# EAGLE schematic module_core_2 (EAGLE 5.10)
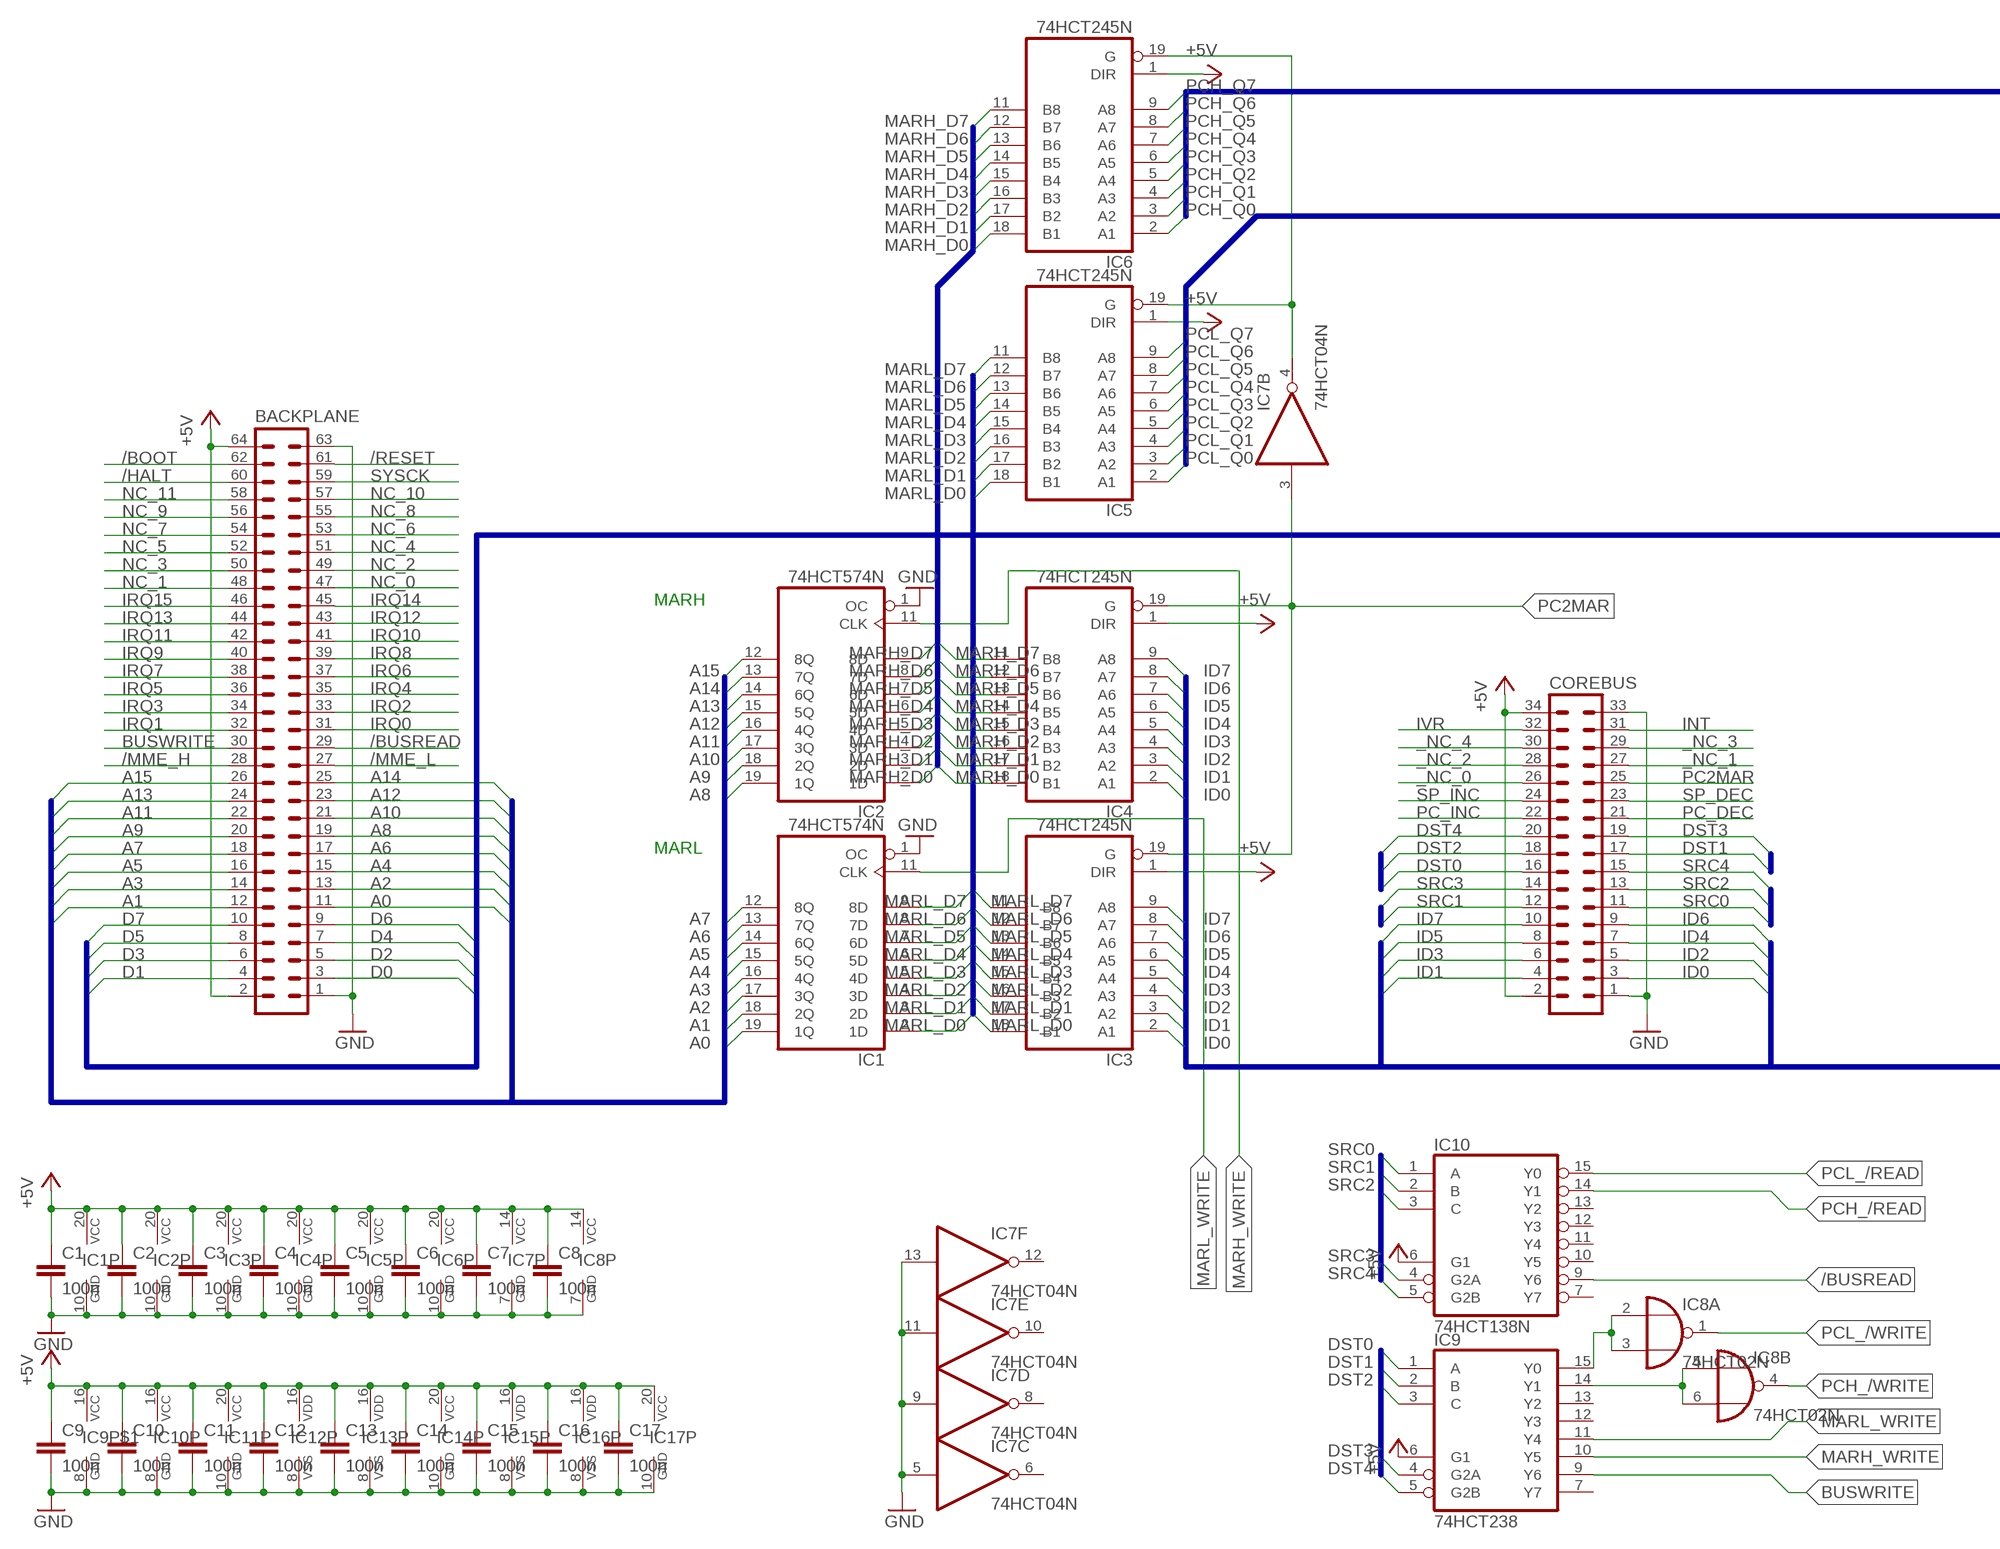
[diagram p0: schematic, sheet 1, part 1 of 2]
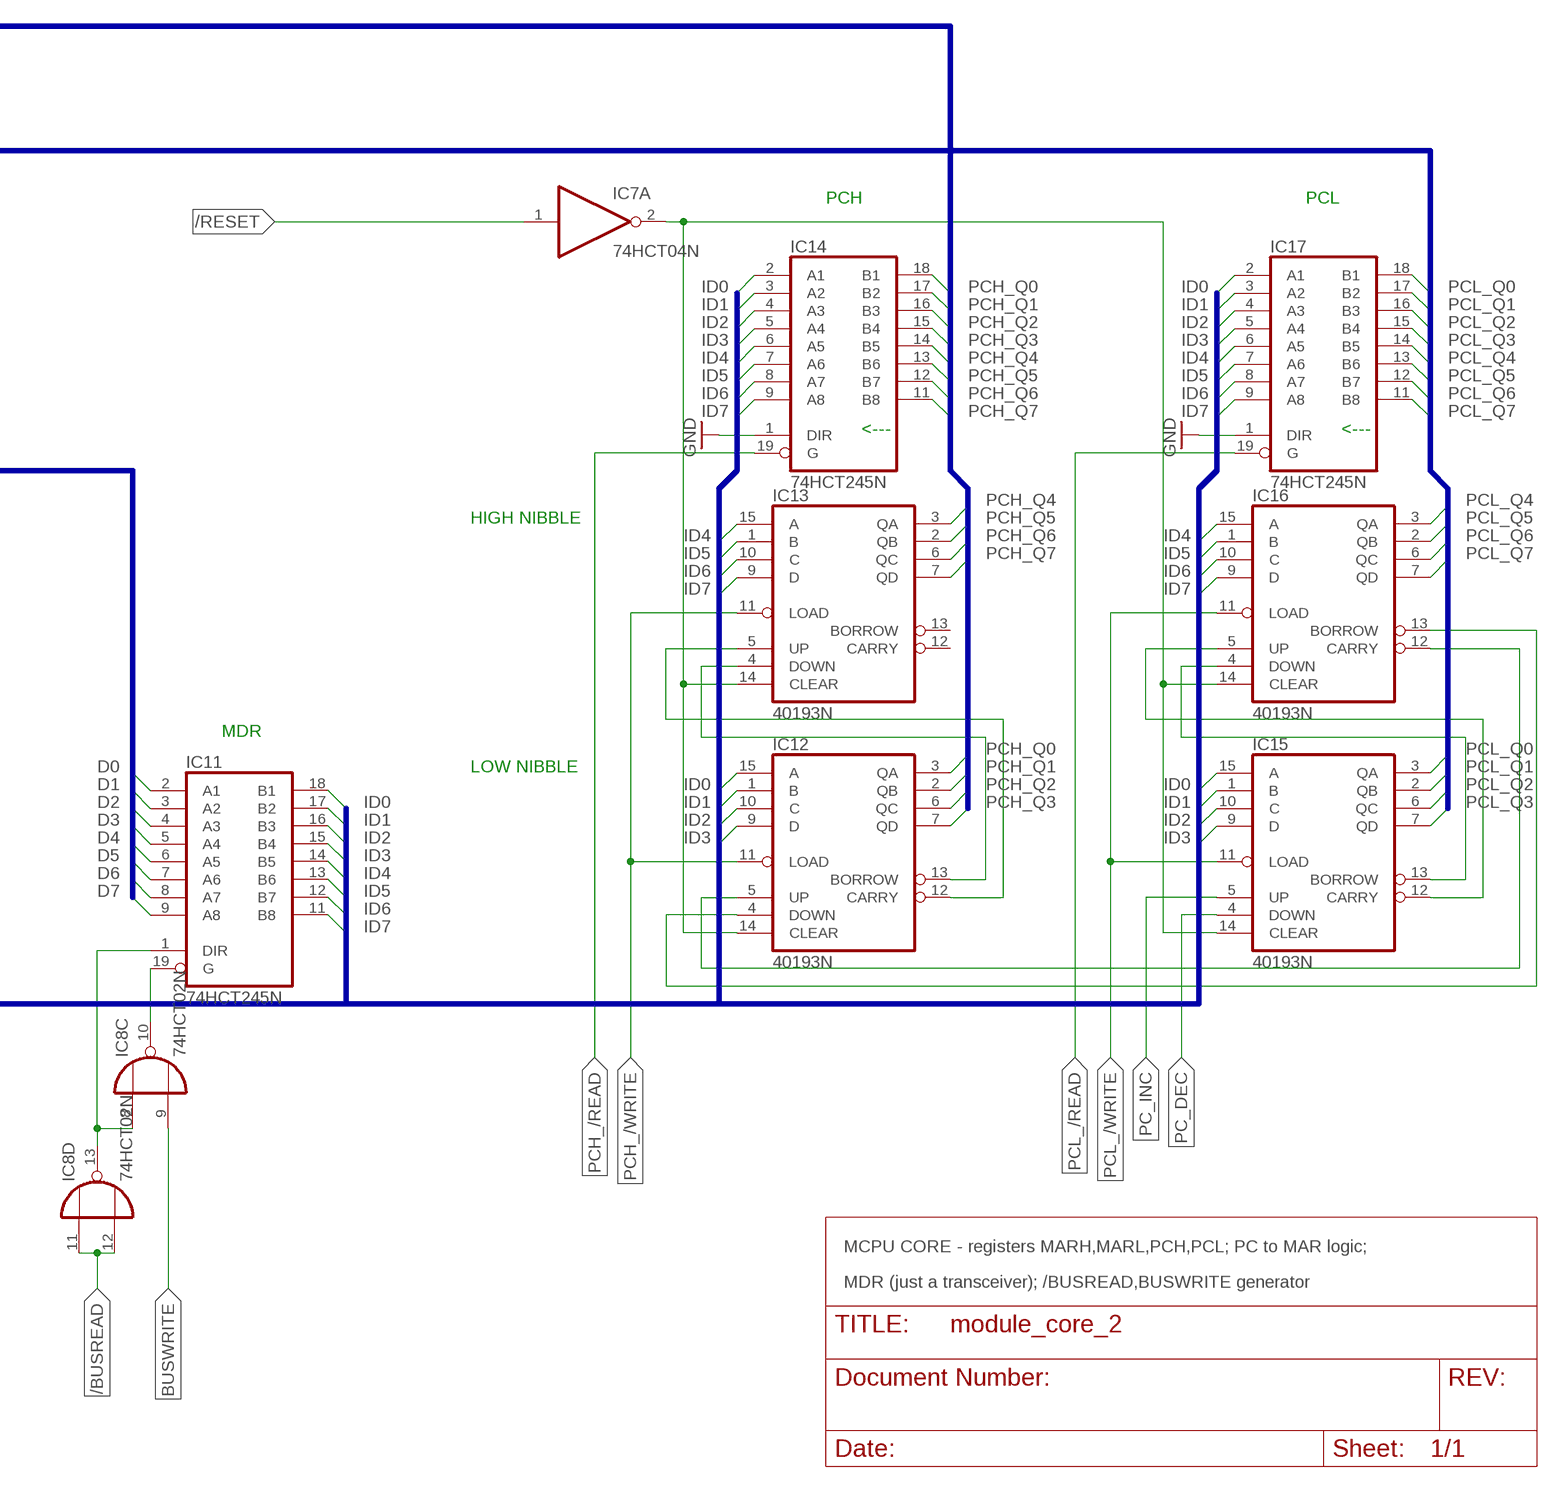
[diagram p1: schematic, sheet 1, part 2 of 2]

## Parts
BACKPLANE  ML64L  [ML64L]
C1  100n  C-EUC1206  [C1206]
C2  100n  C-EUC1206  [C1206]
C3  100n  C-EUC1206  [C1206]
C4  100n  C-EUC1206  [C1206]
C5  100n  C-EUC1206  [C1206]
C6  100n  C-EUC1206  [C1206]
C7  100n  C-EUC1206  [C1206]
C8  100n  C-EUC1206  [C1206]
C9  100n  C-EUC1206  [C1206]
C10  100n  C-EUC1206  [C1206]
C11  100n  C-EUC1206  [C1206]
C12  100n  C-EUC1206  [C1206]
C13  100n  C-EUC1206  [C1206]
C14  100n  C-EUC1206  [C1206]
C15  100n  C-EUC1206  [C1206]
C16  100n  C-EUC1206  [C1206]
C17  100n  C-EUC1206  [C1206]
COREBUS  ML34L  [ML34L]
IC1  74HCT574N  [DIL20]
IC2  74HCT574N  [DIL20]
IC3  74HCT245N  [DIL20]
IC4  74HCT245N  [DIL20]
IC5  74HCT245N  [DIL20]
IC6  74HCT245N  [DIL20]
IC7  74HCT04N  [DIL14]
IC8  74HCT02N  [DIL14]
IC9  74HCT238  [DIL16]
IC10  74HCT138N  [DIL16]
IC11  74HCT245N  [DIL20]
IC12  40193N  [DIL16]
IC13  40193N  [DIL16]
IC14  74HCT245N  [DIL20]
IC15  40193N  [DIL16]
IC16  40193N  [DIL16]
IC17  74HCT245N  [DIL20]

## Nets
+5V: BACKPLANE.2 BACKPLANE.64 C1.1 C2.1 C3.1 C4.1 C5.1 C6.1 C7.1 C8.1 C9.1 C10.1 C11.1 C12.1 C13.1 C14.1 C15.1 C16.1 C17.1 COREBUS.2 COREBUS.34 IC1.20(VCC) IC2.20(VCC) IC3.1(DIR) IC3.20(VCC) IC4.1(DIR) IC4.20(VCC) IC5.1(DIR) IC5.20(VCC) IC6.1(DIR) IC6.20(VCC) IC7.14(P:VCC) IC8.14(P:VCC) IC9.6(G1) IC9.16(VCC) IC10.6(G1) IC10.16(VCC) IC11.20(VCC) IC12.16(VDD) IC13.16(VDD) IC14.20(VCC) IC15.16(VDD) IC16.16(VDD) IC17.20(VCC)
/BOOT: BACKPLANE.62
/BUSREAD: BACKPLANE.29 IC8.11(D:I0) IC8.12(D:I1) IC10.9(Y6)
/HALT: BACKPLANE.60
/MME_H: BACKPLANE.28
/MME_L: BACKPLANE.27
/RESET: BACKPLANE.61 IC7.1(A:I)
_NC_0: COREBUS.26
_NC_1: COREBUS.27
_NC_2: COREBUS.28
_NC_3: COREBUS.29
_NC_4: COREBUS.30
A0: BACKPLANE.11 IC1.19(1Q)
A1: BACKPLANE.12 IC1.18(2Q)
A2: BACKPLANE.13 IC1.17(3Q)
A3: BACKPLANE.14 IC1.16(4Q)
A4: BACKPLANE.15 IC1.15(5Q)
A5: BACKPLANE.16 IC1.14(6Q)
A6: BACKPLANE.17 IC1.13(7Q)
A7: BACKPLANE.18 IC1.12(8Q)
A8: BACKPLANE.19 IC2.19(1Q)
A9: BACKPLANE.20 IC2.18(2Q)
A10: BACKPLANE.21 IC2.17(3Q)
A11: BACKPLANE.22 IC2.16(4Q)
A12: BACKPLANE.23 IC2.15(5Q)
A13: BACKPLANE.24 IC2.14(6Q)
A14: BACKPLANE.25 IC2.13(7Q)
A15: BACKPLANE.26 IC2.12(8Q)
BUSWRITE: BACKPLANE.30 IC8.9(C:I1) IC9.9(Y6)
D0: BACKPLANE.3 IC11.2(A1)
D1: BACKPLANE.4 IC11.3(A2)
D2: BACKPLANE.5 IC11.4(A3)
D3: BACKPLANE.6 IC11.5(A4)
D4: BACKPLANE.7 IC11.6(A5)
D5: BACKPLANE.8 IC11.7(A6)
D6: BACKPLANE.9 IC11.8(A7)
D7: BACKPLANE.10 IC11.9(A8)
DST0: COREBUS.16 IC9.1(A)
DST1: COREBUS.17 IC9.2(B)
DST2: COREBUS.18 IC9.3(C)
DST3: COREBUS.19 IC9.4(G2A)
DST4: COREBUS.20 IC9.5(G2B)
GND: BACKPLANE.1 BACKPLANE.63 C1.2 C2.2 C3.2 C4.2 C5.2 C6.2 C7.2 C8.2 C9.2 C10.2 C11.2 C12.2 C13.2 C14.2 C15.2 C16.2 C17.2 COREBUS.1 COREBUS.33 IC1.1(OC) IC1.10(GND) IC2.1(OC) IC2.10(GND) IC3.10(GND) IC4.10(GND) IC5.10(GND) IC6.10(GND) IC7.5(C:I) IC7.7(P:GND) IC7.9(D:I) IC7.11(E:I) IC7.13(F:I) IC8.7(P:GND) IC9.8(GND) IC10.8(GND) IC11.10(GND) IC12.8(VSS) IC13.8(VSS) IC14.1(DIR) IC14.10(GND) IC15.8(VSS) IC16.8(VSS) IC17.1(DIR) IC17.10(GND)
ID0: COREBUS.3 IC3.2(A1) IC4.2(A1) IC11.18(B1) IC12.15(A) IC14.2(A1) IC15.15(A) IC17.2(A1)
ID1: COREBUS.4 IC3.3(A2) IC4.3(A2) IC11.17(B2) IC12.1(B) IC14.3(A2) IC15.1(B) IC17.3(A2)
ID2: COREBUS.5 IC3.4(A3) IC4.4(A3) IC11.16(B3) IC12.10(C) IC14.4(A3) IC15.10(C) IC17.4(A3)
ID3: COREBUS.6 IC3.5(A4) IC4.5(A4) IC11.15(B4) IC12.9(D) IC14.5(A4) IC15.9(D) IC17.5(A4)
ID4: COREBUS.7 IC3.6(A5) IC4.6(A5) IC11.14(B5) IC13.15(A) IC14.6(A5) IC16.15(A) IC17.6(A5)
ID5: COREBUS.8 IC3.7(A6) IC4.7(A6) IC11.13(B6) IC13.1(B) IC14.7(A6) IC16.1(B) IC17.7(A6)
ID6: COREBUS.9 IC3.8(A7) IC4.8(A7) IC11.12(B7) IC13.10(C) IC14.8(A7) IC16.10(C) IC17.8(A7)
ID7: COREBUS.10 IC3.9(A8) IC4.9(A8) IC11.11(B8) IC13.9(D) IC14.9(A8) IC16.9(D) IC17.9(A8)
INT: COREBUS.31
IRQ0: BACKPLANE.31
IRQ1: BACKPLANE.32
IRQ2: BACKPLANE.33
IRQ3: BACKPLANE.34
IRQ4: BACKPLANE.35
IRQ5: BACKPLANE.36
IRQ6: BACKPLANE.37
IRQ7: BACKPLANE.38
IRQ8: BACKPLANE.39
IRQ9: BACKPLANE.40
IRQ10: BACKPLANE.41
IRQ11: BACKPLANE.42
IRQ12: BACKPLANE.43
IRQ13: BACKPLANE.44
IRQ14: BACKPLANE.45
IRQ15: BACKPLANE.46
IVR: COREBUS.32
MARH_D0: IC2.2(1D) IC4.18(B1) IC6.18(B1)
MARH_D1: IC2.3(2D) IC4.17(B2) IC6.17(B2)
MARH_D2: IC2.4(3D) IC4.16(B3) IC6.16(B3)
MARH_D3: IC2.5(4D) IC4.15(B4) IC6.15(B4)
MARH_D4: IC2.6(5D) IC4.14(B5) IC6.14(B5)
MARH_D5: IC2.7(6D) IC4.13(B6) IC6.13(B6)
MARH_D6: IC2.8(7D) IC4.12(B7) IC6.12(B7)
MARH_D7: IC2.9(8D) IC4.11(B8) IC6.11(B8)
MARH_WRITE: IC2.11(CLK) IC9.10(Y5)
MARL_D0: IC1.2(1D) IC3.18(B1) IC5.18(B1)
MARL_D1: IC1.3(2D) IC3.17(B2) IC5.17(B2)
MARL_D2: IC1.4(3D) IC3.16(B3) IC5.16(B3)
MARL_D3: IC1.5(4D) IC3.15(B4) IC5.15(B4)
MARL_D4: IC1.6(5D) IC3.14(B5) IC5.14(B5)
MARL_D5: IC1.7(6D) IC3.13(B6) IC5.13(B6)
MARL_D6: IC1.8(7D) IC3.12(B7) IC5.12(B7)
MARL_D7: IC1.9(8D) IC3.11(B8) IC5.11(B8)
MARL_WRITE: IC1.11(CLK) IC9.11(Y4)
N$1: IC8.8(C:I0) IC8.13(D:O) IC11.1(DIR)
N$2: IC12.13(BORROW) IC13.4(DOWN)
N$3: IC5.19(G) IC6.19(G) IC7.4(B:O)
N$5: IC8.10(C:O) IC11.19(G)
N$6: IC12.12(CARRY) IC13.5(UP)
N$7: IC15.13(BORROW) IC16.4(DOWN)
N$8: IC15.12(CARRY) IC16.5(UP)
N$9: IC12.5(UP) IC16.12(CARRY)
N$10: IC12.4(DOWN) IC16.13(BORROW)
N$13: IC8.2(A:I0) IC8.3(A:I1) IC9.15(Y0)
N$14: IC8.5(B:I0) IC8.6(B:I1) IC9.14(Y1)
NC_0: BACKPLANE.47
NC_1: BACKPLANE.48
NC_2: BACKPLANE.49
NC_3: BACKPLANE.50
NC_4: BACKPLANE.51
NC_5: BACKPLANE.52
NC_6: BACKPLANE.53
NC_7: BACKPLANE.54
NC_8: BACKPLANE.55
NC_9: BACKPLANE.56
NC_10: BACKPLANE.57
NC_11: BACKPLANE.58
PC2MAR: COREBUS.25 IC3.19(G) IC4.19(G) IC7.3(B:I)
PC_DEC: COREBUS.21 IC15.4(DOWN)
PC_INC: COREBUS.22 IC15.5(UP)
PCH_/READ: IC10.14(Y1) IC14.19(G)
PCH_/WRITE: IC8.4(B:O) IC12.11(LOAD) IC13.11(LOAD)
PCH_Q0: IC6.2(A1) IC12.3(QA) IC14.18(B1)
PCH_Q1: IC6.3(A2) IC12.2(QB) IC14.17(B2)
PCH_Q2: IC6.4(A3) IC12.6(QC) IC14.16(B3)
PCH_Q3: IC6.5(A4) IC12.7(QD) IC14.15(B4)
PCH_Q4: IC6.6(A5) IC13.3(QA) IC14.14(B5)
PCH_Q5: IC6.7(A6) IC13.2(QB) IC14.13(B6)
PCH_Q6: IC6.8(A7) IC13.6(QC) IC14.12(B7)
PCH_Q7: IC6.9(A8) IC13.7(QD) IC14.11(B8)
PCL_/READ: IC10.15(Y0) IC17.19(G)
PCL_/WRITE: IC8.1(A:O) IC15.11(LOAD) IC16.11(LOAD)
PCL_Q0: IC5.2(A1) IC15.3(QA) IC17.18(B1)
PCL_Q1: IC5.3(A2) IC15.2(QB) IC17.17(B2)
PCL_Q2: IC5.4(A3) IC15.6(QC) IC17.16(B3)
PCL_Q3: IC5.5(A4) IC15.7(QD) IC17.15(B4)
PCL_Q4: IC5.6(A5) IC16.3(QA) IC17.14(B5)
PCL_Q5: IC5.7(A6) IC16.2(QB) IC17.13(B6)
PCL_Q6: IC5.8(A7) IC16.6(QC) IC17.12(B7)
PCL_Q7: IC5.9(A8) IC16.7(QD) IC17.11(B8)
RESET: IC7.2(A:O) IC12.14(CLEAR) IC13.14(CLEAR) IC15.14(CLEAR) IC16.14(CLEAR)
SP_DEC: COREBUS.23
SP_INC: COREBUS.24
SRC0: COREBUS.11 IC10.1(A)
SRC1: COREBUS.12 IC10.2(B)
SRC2: COREBUS.13 IC10.3(C)
SRC3: COREBUS.14 IC10.4(G2A)
SRC4: COREBUS.15 IC10.5(G2B)
SYSCK: BACKPLANE.59
Unconnected: IC7.6(C:O) IC7.8(D:O) IC7.10(E:O) IC7.12(F:O) IC9.7(Y7) IC9.12(Y3) IC9.13(Y2) IC10.7(Y7) IC10.10(Y5) IC10.11(Y4) IC10.12(Y3) IC10.13(Y2) IC13.12(CARRY) IC13.13(BORROW)

## Buses
D[0..7]
A[0..15]
ID[0..7]
DST[0..4]
SRC[0..4]
PCH_Q[0..7]
PCL_Q[0..7]
MARL_D[0..7]
MARH_D[0..7]

## Notes on the sheet
- PCH | PCL
- <--- | <---
- HIGH NIBBLE
- MARH
- MDR
- LOW NIBBLE
- MARL
- MCPU CORE - registers MARH,MARL,PCH,PCL; PC to MAR logic;
- MDR (just a transceiver); /BUSREAD,BUSWRITE generator

## Library data of the parts
BACKPLANE = mcpu:ML64L: HARTING
C1-C17 = rcl:C-EU: CAPACITOR, European symbol
COREBUS = mcpu:ML34L: HARTING
IC1 IC2 = 74xx-eu:74*574: 8-bit D type FLIP FLOP bus driver
IC3-IC6 IC11 IC14 IC17 = 74xx-eu:74*245: Octal BUS TRANSCEIVER, 3-state
IC7 = 74xx-eu:74*04: Hex INVERTER
IC8 = 74xx-eu:74*02: Quad 2-input NOR gate
IC9 = 74xx-eu:74*238: 3 TO 8 LINE DECODER (DEMULTIPLEXER)
IC10 = 74xx-eu:74*138: 3-line to 8-line DECODER/DEMULTIPLEXER
IC12 IC13 IC15 IC16 = 40xx:40193: Binary up down COUNTER

## Net classes
0 Signal: width 0.305 mm, drill 0.508 mm, clearance 0.203 mm
1 LoVolt42: width 0.61 mm, drill 0.508 mm, clearance 0.813 mm to class 0, clearance 0.305 mm
2 MedVolt100: width 0.61 mm, drill 0.508 mm, clearance 1.626 mm to class 0, clearance 1.626 mm to class 1, clearance 0.813 mm
3 LineVolt350: width 0.813 mm, drill 0.508 mm, clearance 12.7 mm to class 0, clearance 12.7 mm to class 1, clearance 12.7 mm to class 2, clearance 2.54 mm